# Altium schematic sheet Sheet2.SchDoc
size A; SheetNumber: 1; SheetTotal: 1
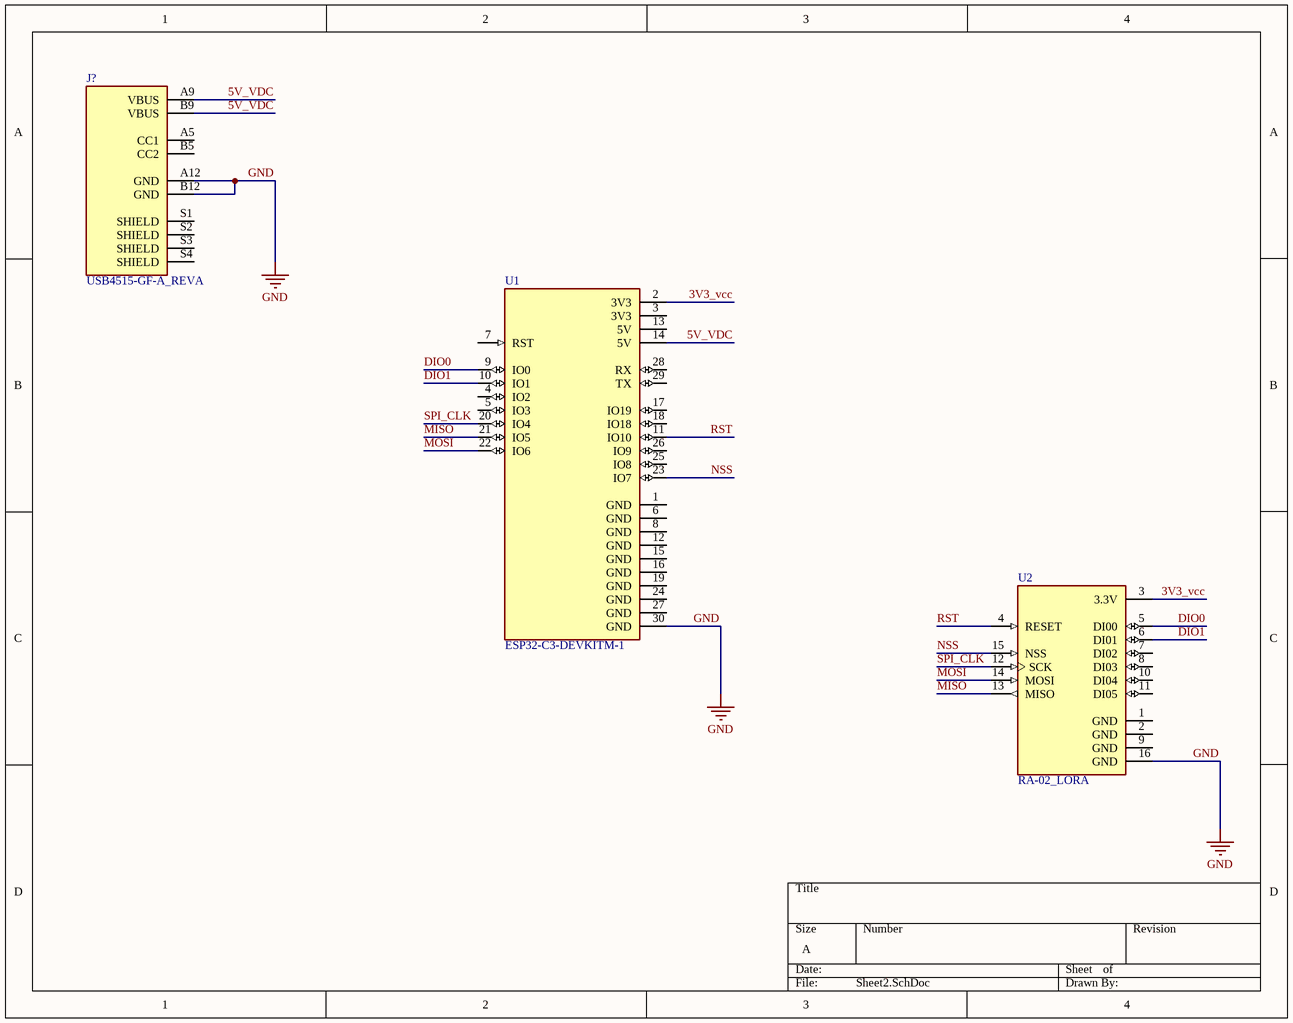
[diagram p0: Sheet2.SchDoc]

## Parts
J?  USB4515-GF-A_REVA  [GCT_USB4515-GF-A_REVA]
U1  ESP32-C3-DEVKITM-1  [XCVR_ESP32-C3-DEVKITM-1]
U2  RA-02_LORA  [MODULE_RA-02_LORA]

## Nets
GND: J?.A12(GND) J?.B12(GND) U1.30(GND) U2.16(GND)
3V3_vcc: U1.2(3V3) U2.3(3.3V)
5V_VDC: J?.A9(VBUS) J?.B9(VBUS) U1.14(5V)
DIO0: U1.9(IO0) U2.5(DI00)
DIO1: U1.10(IO1) U2.6(DI01)
MISO: U1.21(IO5) U2.13(MISO)
MOSI: U1.22(IO6) U2.14(MOSI)
NSS: U1.23(IO7) U2.15(NSS)
RST: U1.11(IO10) U2.4(RESET)
SPI_CLK: U1.20(IO4) U2.12(SCK)

Not connected (* = marked no-connect by the designer): J? A5(CC1) B5(CC2) S1(SHIELD) S2(SHIELD) S3(SHIELD) S4(SHIELD); U1 1(GND) 3(3V3) 4(IO2) 5(IO3) 6(GND) 7(RST) 8(GND) 12(GND) 13(5V) 15(GND) 16(GND) 17(IO19) 18(IO18) 19(GND) 24(GND) 25(IO8) 26(IO9) 27(GND) 28(RX) 29(TX); U2 1(GND) 2(GND) 7(DI02) 8(DI03) 9(GND) 10(DI04) 11(DI05)

## Library data of the parts
J? = USB4515-GF-A_REVA: MF: {'manufacturer': u'Global Connector Technology'}; Package: None; Price: None; Value: *; MP: USB4515-GF-A_REVA; Availability: Unavailable
U1 = ESP32-C3-DEVKITM-1: MF: {'manufacturer': u'Espressif Systems'}; Package: None; Price: None; Value: *; MP: ESP32-C3-DEVKITM-1; Availability: Unavailable
U2 = RA-02_LORA: Ra-02 LoRa RF M5Stack Platform Evaluation Expansion Board; MF: {'manufacturer': u'AI-Thinker'}; Package: None; Price: None; Value: *; MP: RA-02_LORA; Availability: Unavailable